# Altium project FOSS JTAG.PrjPCB
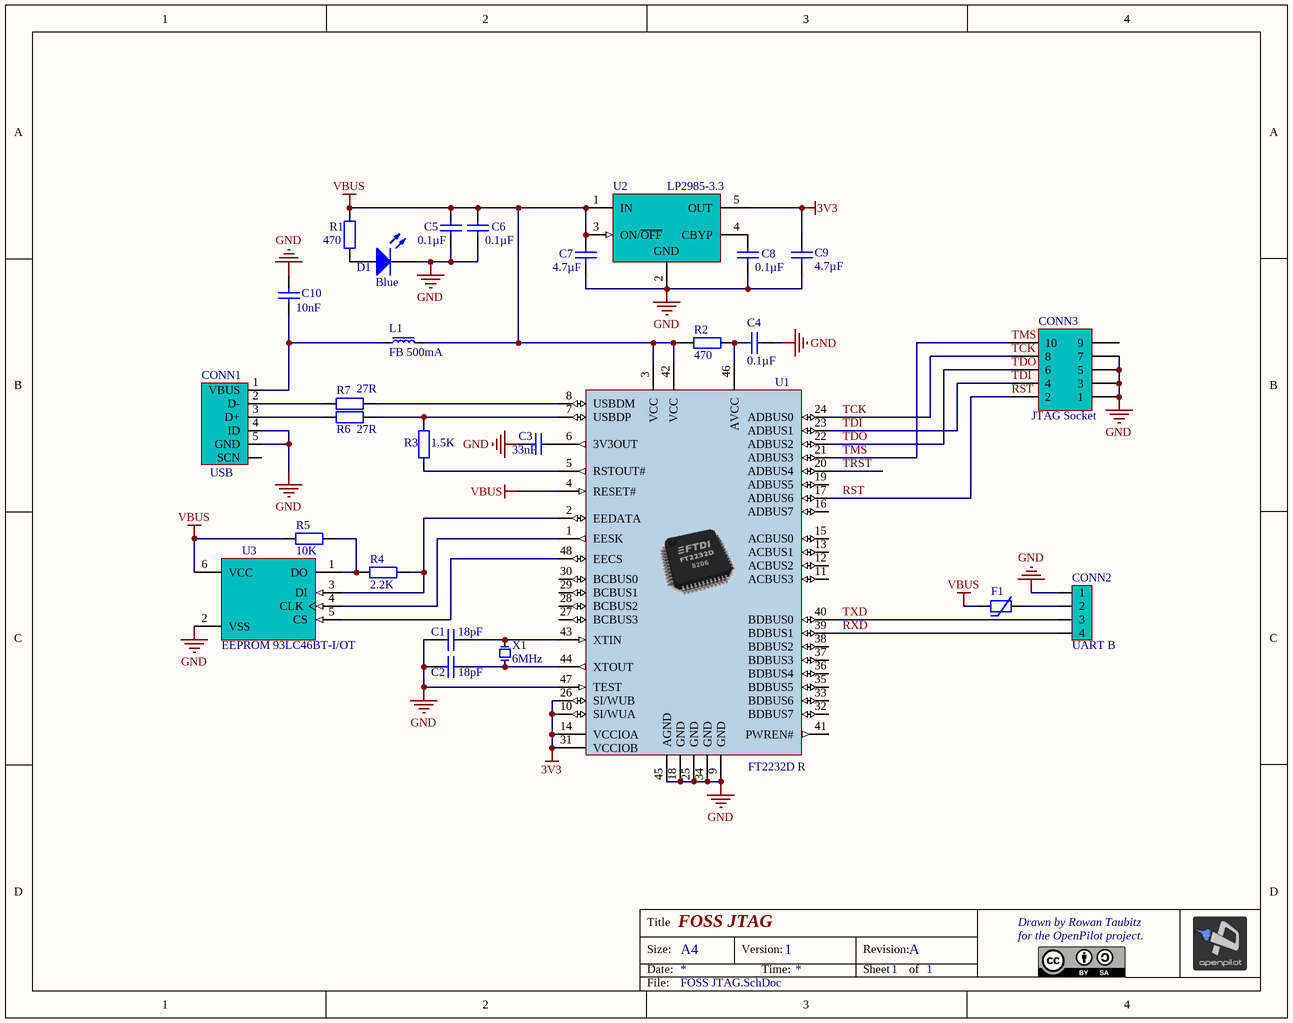
[diagram p0: FOSS JTAG.SchDoc]
Title: Floss-JTAG
1 sheet, 27 parts. Net scope: global (net labels, ports and power ports of the same name join across sheets).
Board file: FOSS JTAG.PcbDoc

## Sheet FOSS JTAG.SchDoc: FOSS JTAG
size A; CheckedBy: Cathy Moss; Author: Rowan Taubitz; DrawnBy: Rowan Taubitz; Engineer: Rowan Taubitz; Organization: The OpenPilot Project; DocumentNumber: 1; Revision: A; SheetNumber: 1; SheetTotal: 1; License: Creative Commons BY-SA; ProjectName: FOSS JTAG

### Parts
C1  value 18pF  [CAP603N]  (hidden comment: Cap603)
C2  value 18pF  [CAP603N]  (hidden comment: Cap603)
C3  value 33nF  [CAP603N]  (hidden comment: Cap603)
C4  value 0.1µF  [CAP603L]  (hidden comment: Cap603)
C5  value 0.1µF  [CAP603N]  (hidden comment: Cap603)
C6  value 0.1µF  [CAP603N]  (hidden comment: Cap603)
C7  value 4.7µF  [CAP603N]  (hidden comment: Cap603)
C8  value 0.1µF  [CAP603N]  (hidden comment: Cap603)
C9  value 4.7µF  [CAP603N]  (hidden comment: Cap603)
C10  value 10nF  [CAP603N]  (hidden comment: Cap603)
CONN1  USB  [USB SMD]
CONN2  UART B  [JST SH 4 Pin Side Entry]
CONN3  JTAG Socket  [JTAG Sock 10-Pin]
D1  Blue  [LED603N]
F1  MF-MSMF030-2  [PTC1206N]  (value not drawn)
L1  FB 500mA  [IND603N]
R1  value 470  [RES603N]  (hidden comment: Res603)
R2  value 470  [RES603N]  (hidden comment: Res603)
R3  value 1.5K  [RES603N]  (hidden comment: Res603)
R4  value 2.2K  [RES603N]  (hidden comment: Res603)
R5  value 10K  [RES603N]  (hidden comment: Res603)
R6  value 27R  [RES603N]  (hidden comment: Res603)
R7  value 27R  [RES603N]  (hidden comment: Res603)
U1  FT2232D R  [FT2232D_M]
U2  LP2985-3.3  [SOT23-5N]
U3  EEPROM 93LC46BT-I/OT  [SOT23-6AM]
X1  6MHz  [XTAL ABMM-6.000MHZ-B2-T]

### Nets
3V3: C9.2 U1.10(SI/WUA) U1.14(VCCIOA) U1.26(SI/WUB) U1.31(VCCIOB) U2.5(OUT)
GND: C1.1 C2.1 C3.1 C4.1 C5.1 C6.1 C7.1 C8.1 C9.1 C10.2 CONN1.4(ID) CONN1.5(GND) CONN2.0 CONN2.1 CONN3.1 CONN3.3 CONN3.5 CONN3.7 D1.1(K) U1.9(GND) U1.18(GND) U1.25(GND) U1.34(GND) U1.45(AGND) U1.47(TEST) U2.2(GND) U3.2(VSS)
VBUS: C5.2 C6.2 C7.2 F1.2 L1.2 R1.1 R2.1 R5.2 U1.3(VCC) U1.4(RESET#) U1.42(VCC) U2.1(IN) U2.3(ON/~{OFF}) U3.6(VCC)
RST: CONN3.2 U1.17(ADBUS6)
RXD: CONN2.4 U1.39(BDBUS1)
TCK: CONN3.8 U1.24(ADBUS0)
TDI: CONN3.4 U1.23(ADBUS1)
TDO: CONN3.6 U1.22(ADBUS2)
TMS: CONN3.10 U1.21(ADBUS3)
TRST: U1.20(ADBUS4)
TXD: CONN2.3 U1.40(BDBUS0)
NetC1_2: C1.2 U1.43(XTIN) X1.1
NetC2_2: C2.2 U1.44(XTOUT) X1.3
NetC3_2: C3.2 U1.6(3V3OUT)
NetC4_2: C4.2 R2.2 U1.46(AVCC)
NetC8_2: C8.2 U2.4(CBYP)
NetC10_1: C10.1 CONN1.1(VBUS) L1.1
NetCONN1_2: CONN1.2(D-) R7.1
NetCONN1_3: CONN1.3(D+) R6.1
NetCONN2_2: CONN2.2 F1.1
NetD1_2: D1.2(A) R1.2
NetR3_1: R3.1 R6.2 U1.7(USBDP)
NetR3_2: R3.2 U1.5(RSTOUT#)
NetR4_1: R4.1 R5.1 U3.1(DO)
NetR4_2: R4.2 U1.2(EEDATA) U3.3(DI)
NetR7_2: R7.2 U1.8(USBDM)
NetU1_1: U1.1(EESK) U3.4(CLK)
NetU1_48: U1.48(EECS) U3.5(CS)

Not connected (* = marked no-connect by the designer): CONN1 0(SCN); CONN3 9; U1 11(ACBUS3) 12(ACBUS2) 13(ACBUS1) 15(ACBUS0) 16(ADBUS7) 19(ADBUS5) 27(BCBUS3) 28(BCBUS2) 29(BCBUS1) 30(BCBUS0) 32(BDBUS7) 33(BDBUS6) 35(BDBUS5) 36(BDBUS4) 37(BDBUS3) 38(BDBUS2) 41(PWREN#)

### Notes on the sheet
- Title
- Size:
- Date:
- A4
- Version:
- Time:
- Revision:
- Sheet
- of
- Drawn by Rowan Taubitz
- for the OpenPilot project.
- File:

### Library data of the parts
C1-C10 = Cap603: Capacitor SMD; Published: 8-Jun-2000; LatestRevisionDate: 17-Jul-2002; LatestRevisionNote: Re-released for DXP Platform.; PackageReference: RAD-0.3; Publisher: Altium Limited; Supplier 1: Digi-Key
  C1 C2: Supplier Part Number 1: 399-1052-1-ND
  C3: Supplier Part Number 1: 399-3478-1-ND
  C4-C6 C8: Supplier Part Number 1: 399-5089-1-ND
  C7 C9: Supplier Part Number 1: 399-3482-1-ND
  C10: Supplier Part Number 1: 399-1091-1-ND
CONN1 = USB_SMT_B: USB Type-B SMT Socket; Class: Connector; Supplier 1: Digi-Key; Supplier Part Number 1: 670-1190-1-ND
CONN2 = JST-SH 4-pin Side Entry Socket: Manufacturer: Generic Components; Class: Connector; Supplier 1: Digi-Key; Supplier Part Number 1: 455-1804-1-ND
CONN3 = JTAG Socket: Socket, 5-Pin, Dual row; Supplier 1: Digi-Key; Supplier Part Number 1: S9007E-05-ND
D1 = LED 603 Bl: Blue 603 LED; Value: 2.1v 20mA; Supplier 1: Digi-Key; Supplier Part Number 1: 754-1119-1-ND
F1 = PTC 8V 500mA SMD: Supplier 1: Digi-Key; Supplier Part Number 1: 507-1480-1-ND
L1 = FerriteBead 500mA: Ferrite Bead 500mA; Manufacturer: Generic Components; Class: Passive; Supplier 1: Digi-Key; Supplier Part Number 1: 445-1547-1-ND
R1-R7 = Res603: Resistor SMD; Published: 8-Jun-2000; LatestRevisionDate: 17-Jul-2002; LatestRevisionNote: Re-released for DXP Platform.; PackageReference: AXIAL-0.4; Publisher: Altium Limited; Supplier 1: Digi-Key
  R1 R2: Supplier Part Number 1: RHM470HCT-ND
  R3: Supplier Part Number 1: RHM1.50KHCT-ND
  R4: Supplier Part Number 1: RHM2.20KHCT-ND
  R5: Supplier Part Number 1: RHM10.0KHCT-ND
  R6 R7: Supplier Part Number 1: P27.0HCT-ND
U1 = FT2232D: Dual USB UART/FIFO Chip, LQFP-48; Supplier 1: Digi-Key; Supplier Part Number 1: 768-1010-1-ND
U2 = LP2985-3.3: 3.3V 150mA LDO Regulator; Supplier 1: Digi-Key; Supplier Part Number 1: 296-18479-1-ND
U3 = 93LC46BT-I/OT: EEPROM 1K, 64x16-bit, 2.5V, 6-Pin SOT-23, Industrial Temperature, Tape and Reel; Published: 29-Jan-2009; DatasheetVersion: revG, May-2008; PackageVersion: revAW, Oct-2008; PackageReference: SOT-23-OT6; Publisher: Altium Limited; PackageDescription: 6-Lead Plastic Small Outline Transistor (OT) [SOT-23]; Code_IPC: SOT26A-6; ComponentLink1Description: Manufacturer Link; ComponentLink1URL: http://www.microchip.com; ComponentLink2Description: Datasheet; ComponentLink2URL: http://ww1.microchip.com/downloads/en/DeviceDoc/21749G.pdf; ComponentLink3Description: Packaging Specification; ComponentLink3URL: http://ww1.microchip.com/downloads/en/PackagingSpec/00049AW.pdf; Supplier 1: Digi-Key; Supplier Part Number 1: 93LC46BT-I/OTCT-ND
X1 = XTAL ABMM-6.000MHZ-B2-T: SMD Quartz Crystal 6Mhz; Class: Oscillator; SubClass: Crystal Oscillator; Supplier 1: Digi-Key; Supplier Part Number 1: 535-10156-1-ND